# Altium schematic sheet RK3566_CSI.SchDoc
size A3; SheetNumber: 5; SheetTotal: 8
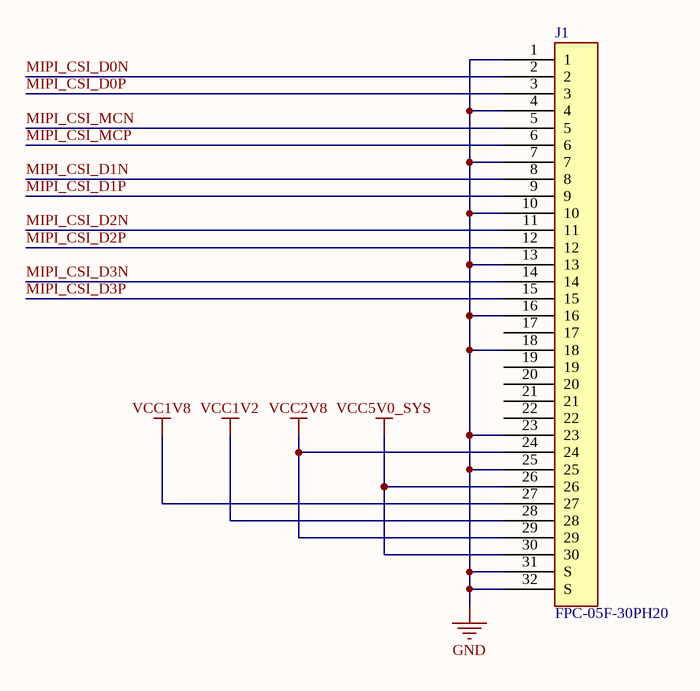
[diagram p0: RK3566_CSI.SchDoc]

## Parts
J1  FPC-05F-30PH20

## Nets
GND: J1.1 J1.4 J1.7 J1.10 J1.13 J1.16 J1.18 J1.23 J1.25 J1.31(S) J1.32(S)
VCC1V2: J1.28
VCC1V8: J1.27
VCC2V8: J1.24 J1.29
VCC5V0_SYS: J1.26 J1.30
MIPI_CSI_D0N: J1.2
MIPI_CSI_D0P: J1.3
MIPI_CSI_D1N: J1.8
MIPI_CSI_D1P: J1.9
MIPI_CSI_D2N: J1.11
MIPI_CSI_D2P: J1.12
MIPI_CSI_D3N: J1.14
MIPI_CSI_D3P: J1.15
MIPI_CSI_MCN: J1.5
MIPI_CSI_MCP: J1.6

Not connected (* = marked no-connect by the designer): J1 17 19 20 21 22